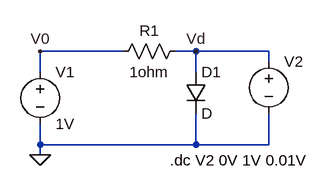
[diagram p0: schematic Diode.asc]
Diode.asc, the LTspice schematic file:
Version 4
SHEET 1 880 680
WIRE 96 128 -32 128
WIRE 208 128 176 128
WIRE 320 128 208 128
WIRE 320 144 320 128
WIRE -32 160 -32 128
WIRE 208 160 208 128
WIRE -32 272 -32 240
WIRE 208 272 208 224
WIRE 208 272 -32 272
WIRE 320 272 320 224
WIRE 320 272 208 272
WIRE -32 288 -32 272
FLAG -32 288 0
FLAG 208 128 Vd
FLAG -32 128 V0
SYMBOL res 80 144 R270
WINDOW 0 32 56 VTop 2
WINDOW 3 0 56 VBottom 2
SYMATTR InstName R1
SYMATTR Value 1ohm
SYMBOL diode 192 160 R0
SYMATTR InstName D1
SYMBOL voltage -32 144 R0
SYMATTR InstName V1
SYMATTR Value 1V
SYMBOL voltage 320 128 R0
WINDOW 123 0 0 Left 0
WINDOW 39 0 0 Left 0
SYMATTR InstName V2
SYMATTR Value ""
TEXT 168 296 Left 2 !.dc V2 0V 1V 0.01V

The netlist it stands for:
* Diode.asc
R1 V0 Vd 1ohm
D1 Vd 0 D
V1 V0 0 1V
V2 Vd 0
.model D D
.lib standard.dio
.dc V2 0V 1V 0.01V
.backanno
.end